# Altium schematic sheet Debug-UART.SchDoc
size A3; DocumentNumber: 6; SheetNumber: 6; SheetTotal: 9; PageSetup: Record=PageOptions|CenterHorizontal=True|CenterVertical=True|PrintScale=0.97|XCorrection=1.00|YCorrection=1.00|PrintKind=1|BorderSize=5000000|LeftOffset=0|BottomOffset=0|Orientation=2|PaperLength=2970|PaperWidth=2100|Scale=100|PaperSource=7|PrintQuality=600|MediaType=1|DitherType=10|PaperKind=A4|PrintScaleMode=1
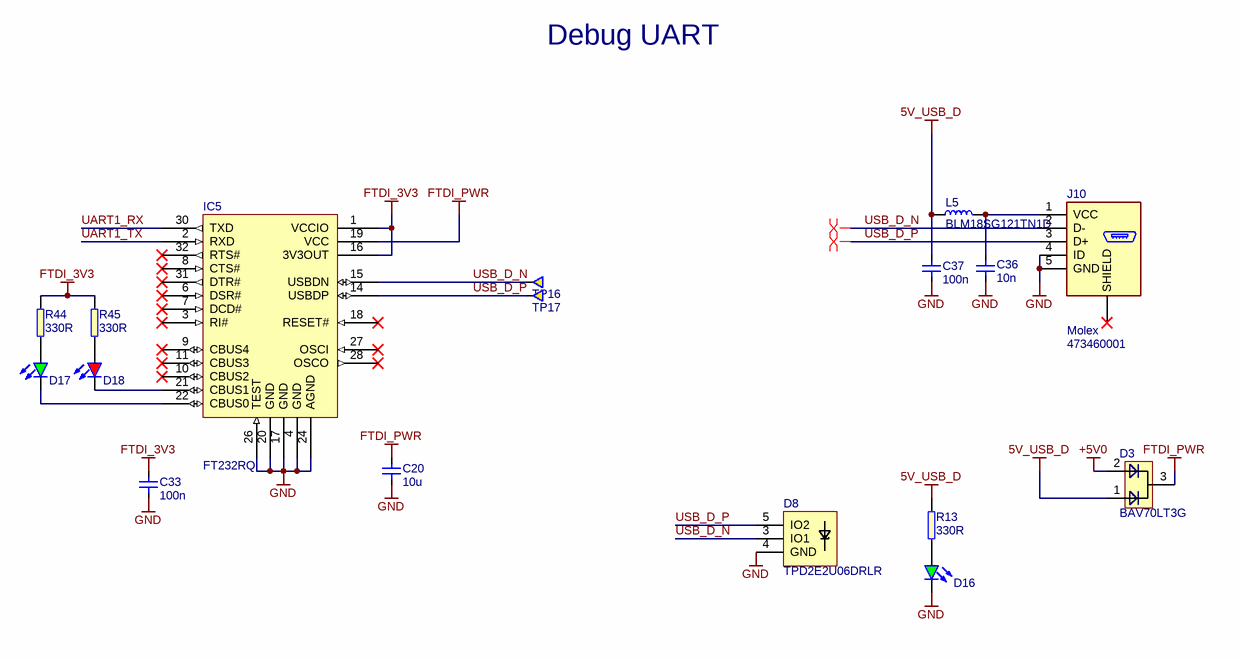
[diagram p0: Debug-UART.SchDoc]

## Parts
C20  10u  [0402]
C33  100n  [0402]
C36  10n  [0402]
C37  100n  [0402]
D3  BAV70LT3G  [SOT-23]
D8  TPD2E2U06DRLR  [TPD2E2U06DRLR]
D16  KPT-1608SGC  [LED0603]  (value not drawn)
D17  KPT-1608SGC  [LED0603]  (value not drawn)
D18  KPT-1608EC  [LED0603]  (value not drawn)
IC5  FT232RQ  [QFN-32]
J10  Manufacturer: Molex  Part Symbol: 473460001  [CON-Molex-047346-0001]  (hidden comment: Molex 47346-0001)
L5  BLM18SG121TN1D  [0603]
R13  330R  [0402]
R44  330R  [0402]
R45  330R  [0402]
TP16  TP-R-1.5  [TP-R-1.5]  (value not drawn)  (no BOM)
TP17  TP-R-1.5  [TP-R-1.5]  (value not drawn)  (no BOM)

## Nets
5V_USB_D: C37.2 D3.1 L5.1 R13.2
+5V0: D3.2
FTDI_3V3: C33.2 IC5.1(VCCIO) IC5.16(3V3OUT) R44.2 R45.2
FTDI_PWR: C20.2 D3.3 IC5.19(VCC)
GND: C20.1 C33.1 C36.2 C37.1 D8.4(GND) D16.K IC5.4(GND) IC5.17(GND) IC5.20(GND) IC5.24(AGND) IC5.26(TEST) J10.4(ID) J10.5(GND)
UART1_RX: IC5.30(TXD)
UART1_TX: IC5.2(RXD)
USB_D_N: D8.3(IO1) IC5.15(USBDN) J10.2(D-) TP16.1
USB_D_P: D8.5(IO2) IC5.14(USBDP) J10.3(D+) TP17.1
NetC36_1: C36.1 J10.1(VCC) L5.2
NetD16_A: D16.A R13.1
NetD17_A: D17.A R44.1
NetD17_K: D17.K IC5.22(CBUS0)
NetD18_A: D18.A R45.1
NetD18_K: D18.K IC5.21(CBUS1)

Not connected (* = marked no-connect by the designer): IC5 3(RI#)* 6(DSR#)* 7(DCD#)* 8(CTS#)* 9(CBUS4)* 10(CBUS2)* 11(CBUS3)* 18(RESET#)* 27(OSCI)* 28(OSCO)* 31(DTR#)* 32(RTS#)*; J10 S(SHIELD)*

## Layout directives
differential pair: USB_D_N, USB_D_P

## Notes on the sheet
- Debug UART
- Title:
- Size:
- Date:
- A3
- Revision:
- Page:
- of
- Antmicro Ltd.
- File:
- www.antmicro.com

## Library data of the parts
C20 = C_10u_0402: MLCC SMT Capacitor 10uF 0402; Manufacturer: TDK; Part Symbol: C1005X5R0J106M050BC; Value: 10u; Part Number: C_10u_0402; MPN: C1005X5R0J106M050BC
C33 C37 = C_100n_0402: MLCC SMT Capacitor 100n 0402; Manufacturer: TDK; Part Symbol: C1005X5R0J104K050BA; Value: 100n; Part Number: C_100n_0402; MPN: C1005X5R0J104K050BA
C36 = C_10n_0402: MLCC SMT Capacitor 10 nF 0402; Manufacturer: AVX; Part Symbol: 04025G103ZAT2A; Value: 10n; Part Number: C_10n_0402; MPN: 04025G103ZAT2A
D3 = BAV70LT3G: Dual switching diode, common cathode; Manufacturer: ON SEMICONDUCTOR; Part Number: BAV70LT3G; Value: BAV70LT3G; Part Symbol: BAV70LT3G; MPN: BAV70LT3G
D8 = TPD2E2U06: ESD Suppressors 2-CH; Manufacturer: Texas Instruments; Part Number: TPD2E2U06; Value: TPD2E2U06DRLR; Part Symbol: TPD2E2U06DRLR; MPN: TPD2E2U06DRLR
D16 D17 = LED_G: LED Green 0603 case; Manufacturer: KINGBRIGHT; Part Number: LED_G; Value: KPT-1608SGC; Part Symbol: KPT-1608SGC; MPN: KPT-1608SGC
D18 = LED_R: LED Red 0603 case; Manufacturer: KINGBRIGHT; Part Number: LED_R; Value: KPT-1608EC; Part Symbol: KPT-1608EC; MPN: KPT-1608EC
IC5 = FT232RQ: USB to serial UART interface; Manufacturer: FTDI; Part Symbol: FT232RQ-REEL; Part Number: FT232RQ; Value: FT232RQ; MPN: FT232RQ-REEL
J10 = Micro USB B: USB - micro B Receptacle Connector 5 Position Surface Mount, Right Angle, Horizontal; Part Number: CON-Molex-47346-0001; Value: Molex 47346-0001; MPN: 473460001
L5 = BLM18SG121TN1D: FERRITE BEAD, 0.025OHM, 3A, 0603; Manufacturer: MURATA; Part Number: BLM18SG121TN1D; Value: BLM18SG121TN1D; Part Symbol: BLM18SG121TN1D; MPN: BLM18SG121TN1D
R13 R44 R45 = R_330R_0402: RES, 330R, 0402; Manufacturer: MULTICOMP; Part Symbol: MCMR04X3300FTL; Value: 330R; Part Number: R_330R_0402; MPN: MCMR04X3300FTL
TP16 TP17 = TP-R-1.5: Testpad, round, 1.5mm; Part Number: TP-R-1.5